# Altium schematic sheet USB Hub.SchDoc: DO NOT FILL THIS IN
size Tabloid; Date: DO NOT FILL THIS IN; ApprovedBy: DO NOT FILL THIS IN; CheckedBy: DO NOT FILL THIS IN; Author: DO NOT FILL THIS IN; CompanyName: DO NOT FILL THIS IN; DrawnBy: DO NOT FILL THIS IN; Engineer: DO NOT FILL THIS IN; Organization: DO NOT FILL THIS IN; Address1: DO NOT FILL THIS IN; Address2: DO NOT FILL THIS IN; Address3: DO NOT FILL THIS IN; Address4: DO NOT FILL THIS IN; DocumentNumber: DO NOT FILL THIS IN; Revision: DO NOT FILL THIS IN; SheetNumber: 9; SheetTotal: 9; PageSetup: Record=PageOptions|CenterHorizontal=True|CenterVertical=True|PrintScale=1.00|XCorrection=1.00|YCorrection=1.00|PrintKind=1|BorderSize=5000000|LeftOffset=0|BottomOffset=0|Orientation=2|PaperLength=1000|PaperWidth=1000|Scale=100|PaperSource=7|PrintQuality=-4|MediaType=1|DitherType=10|PaperKind=Ledger|PrintScaleMode=1; cpr-ItemNumber: 025619; cpr-ItemName1: TurtleBot4 UI board; cpr-ItemName2: Rev 2; cpr-Revision: 2; cpr-SheetNumber: 9; cpr-SheetTotal: 9; cpr-Draft: AG; cpr-DraftDate: 19/04/2022; Time: DO NOT FILL THIS IN; ImagePath: DO NOT FILL THIS IN; Application_BuildNumber: DO NOT FILL THIS IN
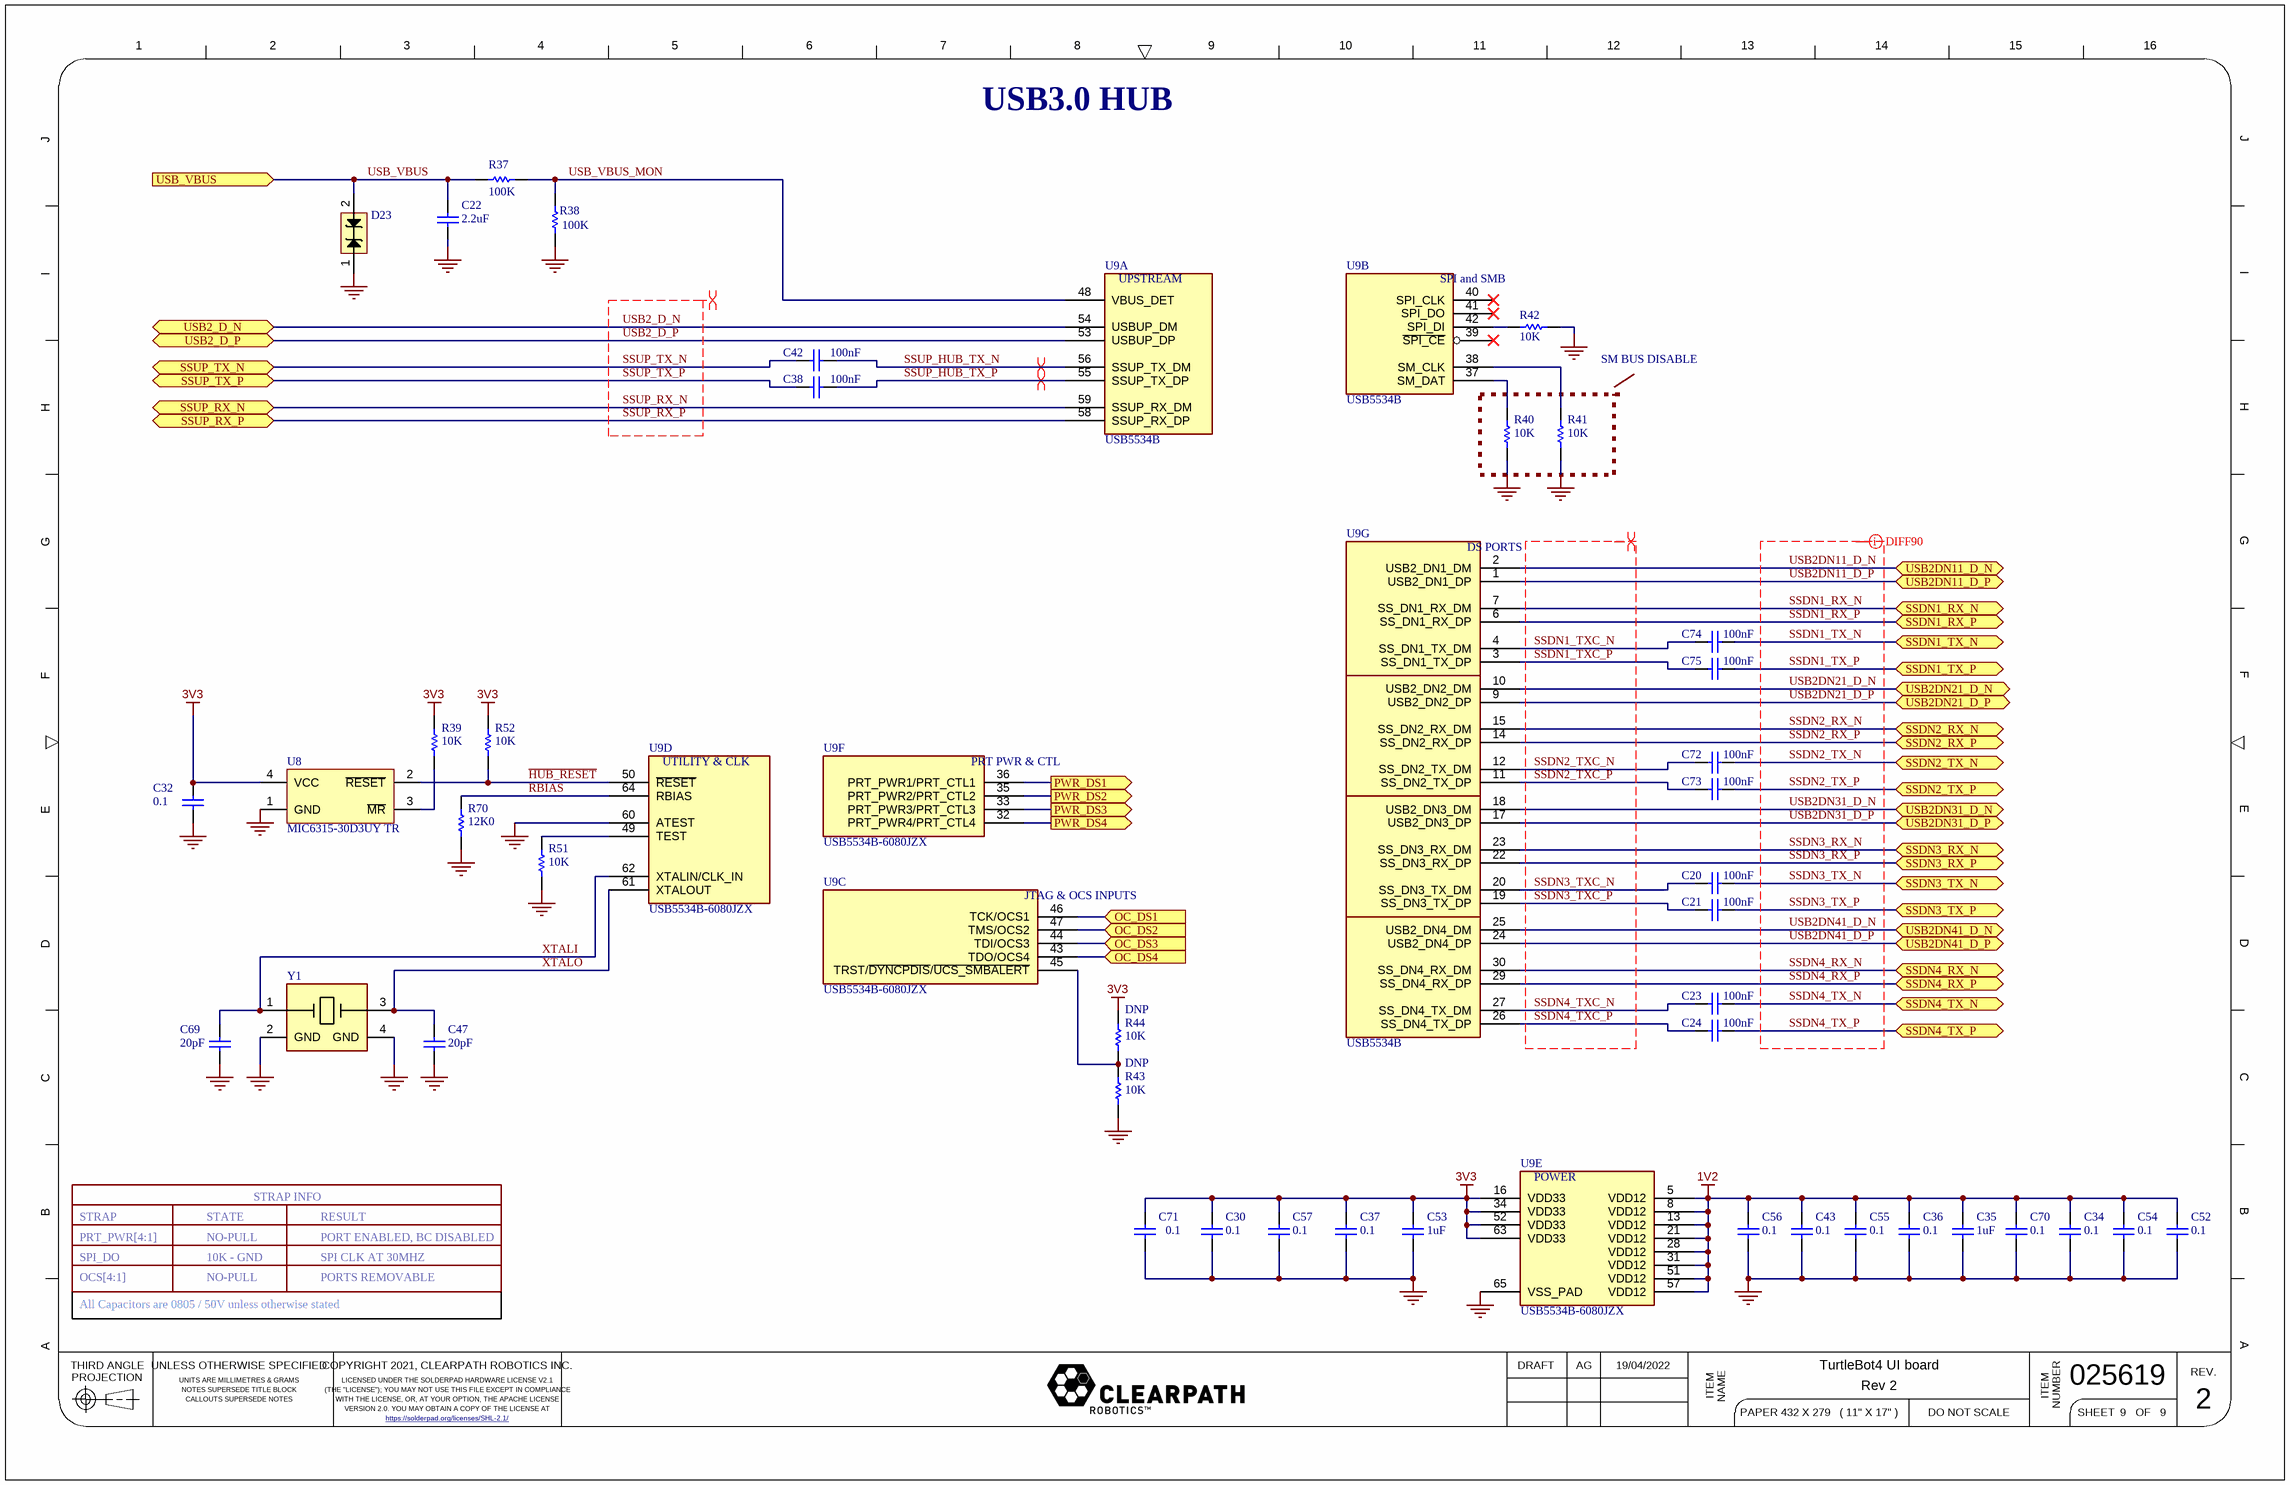
[diagram p0: USB Hub.SchDoc]

## Parts
C20  value 100nF  [CAP 1608[0603]]  (hidden comment: Capacitor _SMT)
C21  value 100nF  [CAP 1608[0603]]  (hidden comment: Capacitor _SMT)
C22  value 2.2uF  [C0805]  (hidden comment: Capacitor _SMT)
C23  value 100nF  [CAP 1608[0603]]  (hidden comment: Capacitor _SMT)
C24  value 100nF  [CAP 1608[0603]]  (hidden comment: Capacitor _SMT)
C30  value 0.1  [C0805]  (hidden comment: Capacitor _SMT)
C32  value 0.1  [C0805]  (hidden comment: Capacitor _SMT)
C34  value 0.1  [C0805]  (hidden comment: Capacitor _SMT)
C35  value 1uF  [C0805]  (hidden comment: Capacitor _SMT)
C36  value 0.1  [C0805]  (hidden comment: Capacitor _SMT)
C37  value 0.1  [C0805]  (hidden comment: Capacitor _SMT)
C38  value 100nF  [CAP 1608[0603]]  (hidden comment: Capacitor _SMT)
C42  value 100nF  [CAP 1608[0603]]  (hidden comment: Capacitor _SMT)
C43  value 0.1  [C0805]  (hidden comment: Capacitor _SMT)
C47  value 20pF  [C0805]  (hidden comment: Capacitor _SMT)
C52  value 0.1  [C0805]  (hidden comment: Capacitor _SMT)
C53  value 1uF  [C0805]  (hidden comment: Capacitor _SMT)
C54  value 0.1  [C0805]  (hidden comment: Capacitor _SMT)
C55  value 0.1  [C0805]  (hidden comment: Capacitor _SMT)
C56  value 0.1  [C0805]  (hidden comment: Capacitor _SMT)
C57  value 0.1  [C0805]  (hidden comment: Capacitor _SMT)
C69  value 20pF  [C0805]  (hidden comment: Capacitor _SMT)
C70  value 0.1  [C0805]  (hidden comment: Capacitor _SMT)
C71  value 0.1  [C0805]  (hidden comment: Capacitor _SMT)
C72  value 100nF  [CAP 1608[0603]]  (hidden comment: Capacitor _SMT)
C73  value 100nF  [CAP 1608[0603]]  (hidden comment: Capacitor _SMT)
C74  value 100nF  [CAP 1608[0603]]  (hidden comment: Capacitor _SMT)
C75  value 100nF  [CAP 1608[0603]]  (hidden comment: Capacitor _SMT)
D23  TVS DIODE BIDIR 15V SMC  [DO-214AA]  (value not drawn)
R37  value 100K  [R0805]  (hidden comment: Resistor_SMT)
R38  value 100K  [R0805]  (hidden comment: Resistor_SMT)
R39  value 10K  [R0805]  (hidden comment: Resistor_SMT)
R40  value 10K  [R0805]  (hidden comment: Resistor_SMT)
R41  value 10K  [R0805]  (hidden comment: Resistor_SMT)
R42  value 10K  [R0805]  (hidden comment: Resistor_SMT)
R43  value 10K  [R0805]  (hidden comment: Resistor_SMT)
R44  value 10K  [R0805]  (hidden comment: Resistor_SMT)
R51  value 10K  [R0805]  (hidden comment: Resistor_SMT)
R52  value 10K  [R0805]  (hidden comment: Resistor_SMT)
R70  value 12K0  [R0805]  (hidden comment: Resistor_SMT)
U8  Mfg PN: MIC6315-30D3UY TR  [SOT143 CPR]  (hidden comment: MIC6315)
U9  USB5534B  [QFN64_9x9_EP]  (parts A,B,C,D,E,F,G of 7)
Y1  ECS-250 crystal  [ECX-53B]  (value not drawn)

## Ports
OC_DS1 (in), OC_DS2 (in), OC_DS3 (in), OC_DS4 (in), PWR_DS1 (out), PWR_DS2 (out), PWR_DS3 (out), PWR_DS4 (out), SSDN1_RX_N (bidir), SSDN1_RX_P (bidir), SSDN1_TX_N (bidir), SSDN1_TX_P (bidir), SSDN2_RX_N (bidir), SSDN2_RX_P (bidir), SSDN2_TX_N (bidir), SSDN2_TX_P (bidir), SSDN3_RX_N (bidir), SSDN3_RX_P (bidir), SSDN3_TX_N (bidir), SSDN3_TX_P (bidir), SSDN4_RX_N (bidir), SSDN4_RX_P (bidir), SSDN4_TX_N (bidir), SSDN4_TX_P (bidir), SSUP_RX_N (bidir), SSUP_RX_P (bidir), SSUP_TX_N (bidir), SSUP_TX_P (bidir), USB2_D_N (bidir), USB2_D_P (bidir), USB2DN11_D_N (bidir), USB2DN11_D_P (bidir), USB2DN21_D_N (bidir), USB2DN21_D_P (bidir), USB2DN31_D_N (bidir), USB2DN31_D_P (bidir), USB2DN41_D_N (bidir), USB2DN41_D_P (bidir), USB_VBUS (in)

## Nets
1V2: C34.2 C35.2 C36.2 C43.2 C52.2 C54.2 C55.2 C56.2 C70.2 U9.5(VDD12) U9.8(VDD12) U9.13(VDD12) U9.21(VDD12) U9.28(VDD12) U9.31(VDD12) U9.51(VDD12) U9.57(VDD12)
3V3: C30.2 C32.2 C37.2 C53.2 C57.2 C71.2 R39.1 R44.1 R52.1 U8.4(VCC) U9.16(VDD33) U9.34(VDD33) U9.52(VDD33) U9.63(VDD33)
GND: C22.1 C30.1 C32.1 C34.1 C35.1 C36.1 C37.1 C43.1 C47.2 C52.1 C53.1 C54.1 C55.1 C56.1 C57.1 C69.2 C70.1 C71.1 D23.1 R38.1 R40.2 R41.2 R42.2 R43.2 R51.2 R70.2 U8.1(GND) U9.60(ATEST) U9.65(VSS_PAD) Y1.2(GND) Y1.4(GND)
~{HUB_RESET}: R52.2 U8.2(~{RESET}) U9.50(~{RESET})
OC_DS1: U9.46(TCK/OCS1) ; port OC_DS1
OC_DS2: U9.47(TMS/OCS2) ; port OC_DS2
OC_DS3: U9.44(TDI/OCS3) ; port OC_DS3
OC_DS4: U9.43(TDO/OCS4) ; port OC_DS4
PWR_DS1: U9.36(PRT_PWR1/PRT_CTL1) ; port PWR_DS1
PWR_DS2: U9.35(PRT_PWR2/PRT_CTL2) ; port PWR_DS2
PWR_DS3: U9.33(PRT_PWR3/PRT_CTL3) ; port PWR_DS3
PWR_DS4: U9.32(PRT_PWR4/PRT_CTL4) ; port PWR_DS4
RBIAS: R70.1 U9.64(RBIAS)
SSDN1_RX_N: U9.7(SS_DN1_RX_DM) ; port SSDN1_RX_N
SSDN1_RX_P: U9.6(SS_DN1_RX_DP) ; port SSDN1_RX_P
SSDN1_TX_N: C74.2 ; port SSDN1_TX_N
SSDN1_TX_P: C75.2 ; port SSDN1_TX_P
SSDN1_TXC_N: C74.1 U9.4(SS_DN1_TX_DM)
SSDN1_TXC_P: C75.1 U9.3(SS_DN1_TX_DP)
SSDN2_RX_N: U9.15(SS_DN2_RX_DM) ; port SSDN2_RX_N
SSDN2_RX_P: U9.14(SS_DN2_RX_DP) ; port SSDN2_RX_P
SSDN2_TX_N: C72.2 ; port SSDN2_TX_N
SSDN2_TX_P: C73.2 ; port SSDN2_TX_P
SSDN2_TXC_N: C72.1 U9.12(SS_DN2_TX_DM)
SSDN2_TXC_P: C73.1 U9.11(SS_DN2_TX_DP)
SSDN3_RX_N: U9.23(SS_DN3_RX_DM) ; port SSDN3_RX_N
SSDN3_RX_P: U9.22(SS_DN3_RX_DP) ; port SSDN3_RX_P
SSDN3_TX_N: C20.2 ; port SSDN3_TX_N
SSDN3_TX_P: C21.2 ; port SSDN3_TX_P
SSDN3_TXC_N: C20.1 U9.20(SS_DN3_TX_DM)
SSDN3_TXC_P: C21.1 U9.19(SS_DN3_TX_DP)
SSDN4_RX_N: U9.30(SS_DN4_RX_DM) ; port SSDN4_RX_N
SSDN4_RX_P: U9.29(SS_DN4_RX_DP) ; port SSDN4_RX_P
SSDN4_TX_N: C23.2 ; port SSDN4_TX_N
SSDN4_TX_P: C24.2 ; port SSDN4_TX_P
SSDN4_TXC_N: C23.1 U9.27(SS_DN4_TX_DM)
SSDN4_TXC_P: C24.1 U9.26(SS_DN4_TX_DP)
SSUP_HUB_TX_N: C42.2 U9.56(SSUP_TX_DM)
SSUP_HUB_TX_P: C38.2 U9.55(SSUP_TX_DP)
SSUP_RX_N: U9.59(SSUP_RX_DM) ; port SSUP_RX_N
SSUP_RX_P: U9.58(SSUP_RX_DP) ; port SSUP_RX_P
SSUP_TX_N: C42.1 ; port SSUP_TX_N
SSUP_TX_P: C38.1 ; port SSUP_TX_P
USB2_D_N: U9.54(USBUP_DM) ; port USB2_D_N
USB2_D_P: U9.53(USBUP_DP) ; port USB2_D_P
USB2DN11_D_N: U9.2(USB2_DN1_DM) ; port USB2DN11_D_N
USB2DN11_D_P: U9.1(USB2_DN1_DP) ; port USB2DN11_D_P
USB2DN21_D_N: U9.10(USB2_DN2_DM) ; port USB2DN21_D_N
USB2DN21_D_P: U9.9(USB2_DN2_DP) ; port USB2DN21_D_P
USB2DN31_D_N: U9.18(USB2_DN3_DM) ; port USB2DN31_D_N
USB2DN31_D_P: U9.17(USB2_DN3_DP) ; port USB2DN31_D_P
USB2DN41_D_N: U9.25(USB2_DN4_DM) ; port USB2DN41_D_N
USB2DN41_D_P: U9.24(USB2_DN4_DP) ; port USB2DN41_D_P
USB_VBUS: C22.2 D23.2 R37.1 ; port USB_VBUS
USB_VBUS_MON: R37.2 R38.2 U9.48(VBUS_DET)
XTALI: C69.1 U9.62(XTALIN/CLK_IN) Y1.1
XTALO: C47.1 U9.61(XTALOUT) Y1.3
NetR39_2: R39.2 U8.3(~{MR})
NetR40_1: R40.1 U9.37(SM_DAT)
NetR41_1: R41.1 U9.38(SM_CLK)
NetR42_1: R42.1 U9.42(SPI_DI)
NetR43_1: R43.1 R44.2 U9.45(TRST/~{DYNCPDIS}/~{UCS_SMBALERT})
NetR51_1: R51.1 U9.49(TEST)

Not connected (* = marked no-connect by the designer): U9 39(~{SPI_CE})* 40(SPI_CLK)* 41(SPI_DO)*

## Layout directives
differential pair; net class USB3; differential pair class DIFF90; rule Matched Net Lengths [Tolerance = 15mil]: SSDN1_TXC_N, SSDN1_TXC_P, SSDN2_TXC_N, SSDN2_TXC_P, SSDN3_TXC_N, SSDN3_TXC_P, SSDN4_TXC_N, SSDN4_TXC_P, SSUP_HUB_TX_N, SSUP_HUB_TX_P, SSUP_RX_N, SSUP_RX_P, SSUP_TX_N, SSUP_TX_P, USB2_D_N, USB2_D_P
differential pair; differential pair class DIFF90; rule Matched Net Lengths [Tolerance = 15mil]: SSDN1_RX_N, SSDN1_RX_P, SSDN1_TX_N, SSDN1_TX_P, SSDN2_RX_N, SSDN2_RX_P, SSDN2_TX_N, SSDN2_TX_P, SSDN3_RX_N, SSDN3_RX_P, SSDN3_TX_N, SSDN3_TX_P, SSDN4_RX_N, SSDN4_RX_P, SSDN4_TX_N, SSDN4_TX_P, USB2DN11_D_N, USB2DN11_D_P, USB2DN21_D_N, USB2DN21_D_P, USB2DN31_D_N, USB2DN31_D_P, USB2DN41_D_N, USB2DN41_D_P

## Notes on the sheet
- USB3.0 HUB
- SM BUS DISABLE
- STRAP
- PRT_PWR[4:1]
- STATE
- NO-PULL
- STRAP INFO
- RESULT
- PORT ENABLED, BC DISABLED
- SPI_DO
- OCS[4:1]
- 10K - GND
- SPI CLK AT 30MHZ
- PORTS REMOVABLE
- All Capacitors are 0805 / 50V unless otherwise stated
- 1
- 2
- 3
- 4
- 5
- 6
- 7
- 8
- 9
- 10
- 11
- 12
- 13
- 14
- 15
- 16
- J
- I
- H
- G
- F
- E
- D
- C
- B
- A
- THIRD ANGLE
- PROJECTION
- UNLESS OTHERWISE SPECIFIED
- COPYRIGHT 2021, CLEARPATH ROBOTICS INC.
- DRAFT
- REV.
- UNITS ARE MILLIMETRES & GRAMS
- NOTES SUPERSEDE TITLE BLOCK
- CALLOUTS SUPERSEDE NOTES
- LICENSED UNDER THE SOLDERPAD HARDWARE LICENSE V2.1
- (THE "LICENSE"); YOU MAY NOT USE THIS FILE EXCEPT IN COMPLIANCE
- WITH THE LICENSE, OR, AT YOUR OPTION, THE APACHE LICENSE
- VERSION 2.0. YOU MAY OBTAIN A COPY OF THE LICENSE AT
- https://solderpad.org/licenses/SHL-2.1/ <https://solderpad.https://solderpad.org/licenses/SHL-2.1/org/licenses/SHL-2.1/>
- ITEM
- NAME
- PAPER 432 X 279   ( 11" X 17" )
- DO NOT SCALE
- NUMBER
- SHEET
- OF
- (in symbol USB5534B, part A) UPSTREAM
- (in symbol USB5534B, part B) SPI and SMB
- (in symbol USB5534B, part C) JTAG & OCS INPUTS
- (in symbol USB5534B, part D) UTILITY & CLK
- (in symbol USB5534B, part E) POWER
- (in symbol USB5534B, part F) PRT PWR & CTL
- (in symbol USB5534B, part G) DS PORTS

## Library data of the parts
C20 C21 C23 C24 C38 C42 C72-C75 = Capacitor _SMT: Capacitor; Mfg PN: CC0805KRX7R8BB224; Tolerance: 10%; Voltage: 25V; Vendor: Digikey; Vendor PN: 311-1432-1-ND; Mfg: Yageo; DNP: *; Package: 0805
  C42: Supplier 1: Digi-Key; Supplier Part Number 1: 720-1856-1-ND
C22 C35 C53 = Capacitor _SMT: Capacitor; Tolerance: -20 +80; Voltage: 50V; Vendor: Digikey; Vendor PN: 311-1909-1-ND; Mfg: Yageo; Mfg PN: CC0805ZKY5V9BB105; DNP: *; Package: 0805
C30 C32 C34 C36 C37 C43 C52 C54-C57 C70 C71 = Capacitor _SMT: Capacitor; Tolerance: 10%; Voltage: 50V; Vendor: Digikey; Vendor PN: 311-1140-1-ND; Mfg: Yageo; Mfg PN: CC0805KRX7R9BB104; DNP: *; Package: 0805
C47 C69 = Capacitor _SMT: Capacitor; Tolerance: 10%; Voltage: 50V; Vendor: Digikey; Vendor PN: 13-CC0805KRNPO9BN100CT-ND; Mfg: Yageo; Mfg PN: CC0805KRNPO9BN100; DNP: *; Package: 0805
D23 = TVS DIODE BIDIR 15V SMC: TVS 600W 15V BI-DIR DO-214AA; Vendor: Digikey; Vendor PN: 18-SMA6J5.0CACT-ND; Mfg: Littelfuse Inc.; Mfg PN: SMA6J5.0CA; Package: DO214AC; Supplier 1: Digi-Key; Supplier Part Number 1: 18-SMA6J5.0CACT-ND
R37 R38 = Resistor_SMT: Resistor; Vendor: Digikey; Vendor PN: 311-100KCRCT-ND; Tolerance: 1%; Mfg: Yageo; Mfg PN: RC0805FR-07100KL; Power Rating: *; Package: 0805
R39-R44 R51 R52 = Resistor_SMT: Resistor; Vendor: Digikey; Vendor PN: 311-10.0KCRCT-ND; Tolerance: 1%; Mfg: Yageo; Mfg PN: RC0805FR-0710KL; Power Rating: *; Package: 0805
  R43 R44: DNP: DNP
R70 = Resistor_SMT: Resistor; Vendor: Digikey; Tolerance: 1%; Mfg: Yageo; Mfg PN: RC0805FR-0712KL; Vendor 1: 311-12.0KCRCT-ND; Power Rating: *; Package: 0805
U8 = MIC6315: IC RESET GEN 3.00V VTH SOT143-4; Vendor: Digikey; Vendor PN: 576-2890-1-ND; Mfg: Micrel; Package: SOT143
U9 = USB5534B: USB5534B 4-port USB3 hub; Mfg: Microchip; Vendor 1: Digikey; Vendor 1 PN: USB5534B-6080JZX-ND; Vendor 2: Mouser; Vendor 2 PN: 579-USB5534B-6080JZX; Mfg PN: USB5534B-6080JZX; Package: QFN64
Y1 = ECS-250 crystal: Vendor PN: XC1124CT-ND; Mfg: ECS; Vendor: Digikey; Mfg PN: ECS-250-20-30B-TR; Frequency: 25MHz